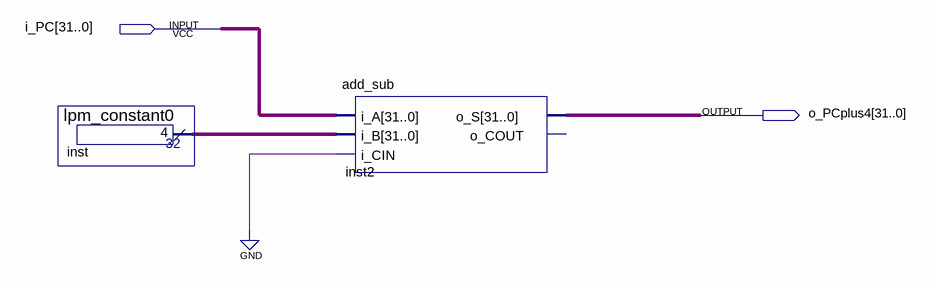
[diagram p0: schematic sheet]
// Quartus schematic add4.bdf as structural Verilog: 2 symbols, 2 pins
module add4 (
  input  [31:0] i_PC,
  output [31:0] o_PCplus4
);

  wire [31:0] inst_result;

  lpm_constant0 inst (.result(inst_result));
  add_sub inst2 (.i_A(i_PC), .i_B(inst_result), .i_CIN(1'b0), .o_S(o_PCplus4));  // open: o_COUT
endmodule
